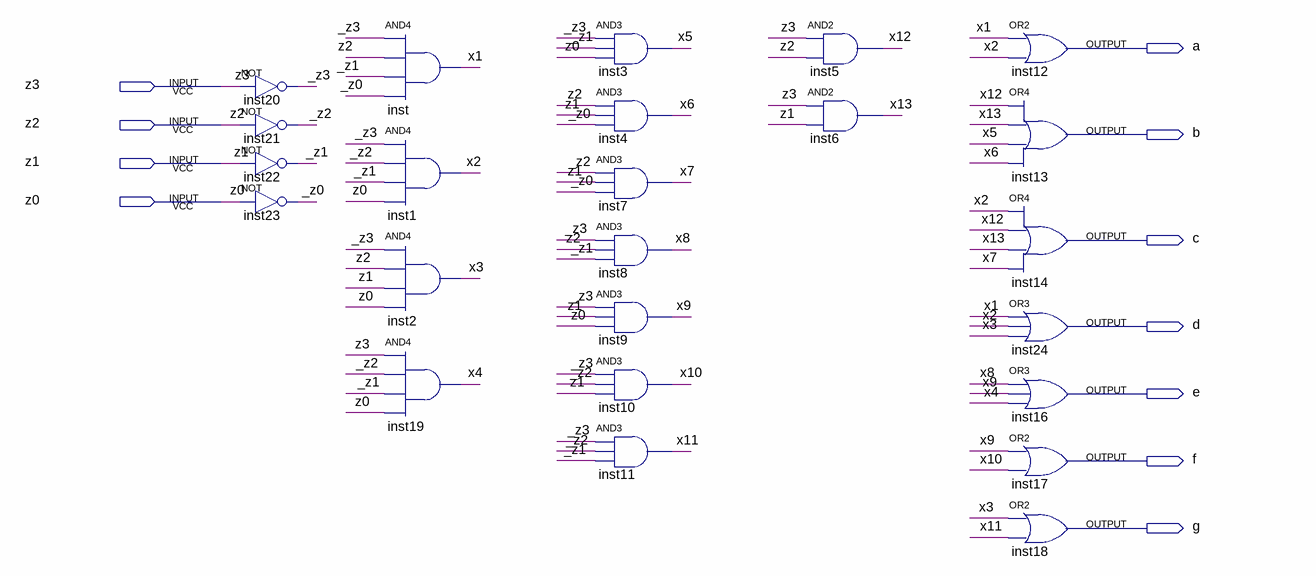
[diagram p0: schematic sheet]
// Quartus schematic dz1.bdf as structural Verilog: 24 symbols, 11 pins
module dz1 (
  input  z3,
  input  z2,
  input  z1,
  input  z0,
  output a,
  output b,
  output c,
  output d,
  output e,
  output f,
  output g
);

  wire _z0, _z1, _z2, _z3, x1, x2, x3, x4, x5, x6, x7, x8, x9, x10, x11, x12, x13;

  not inst20 (_z3, z3);
  not inst21 (_z2, z2);
  not inst22 (_z1, z1);
  not inst23 (_z0, z0);
  and inst (x1, _z3, z2, _z1, _z0);
  and inst1 (x2, _z3, _z2, _z1, z0);
  and inst2 (x3, _z3, z2, z1, z0);
  and inst19 (x4, z3, _z2, _z1, z0);
  and inst3 (x5, _z3, _z1, z0);
  and inst4 (x6, z2, z1, _z0);
  and inst7 (x7, _z2, z1, _z0);
  and inst8 (x8, _z3, z2, _z1);
  and inst9 (x9, _z3, z1, z0);
  and inst10 (x10, _z3, _z2, z1);
  and inst11 (x11, _z3, _z2, _z1);
  and inst5 (x12, z3, z2);
  and inst6 (x13, z3, z1);
  or inst12 (a, x1, x2);
  or inst13 (b, x12, x13, x5, x6);
  or inst14 (c, x2, x12, x13, x7);
  or inst24 (d, x1, x2, x3);
  or inst16 (e, x8, x9, x4);
  or inst17 (f, x9, x10);
  or inst18 (g, x3, x11);
endmodule
